# EAGLE design ModemAdapter (EAGLE 9.4.2)
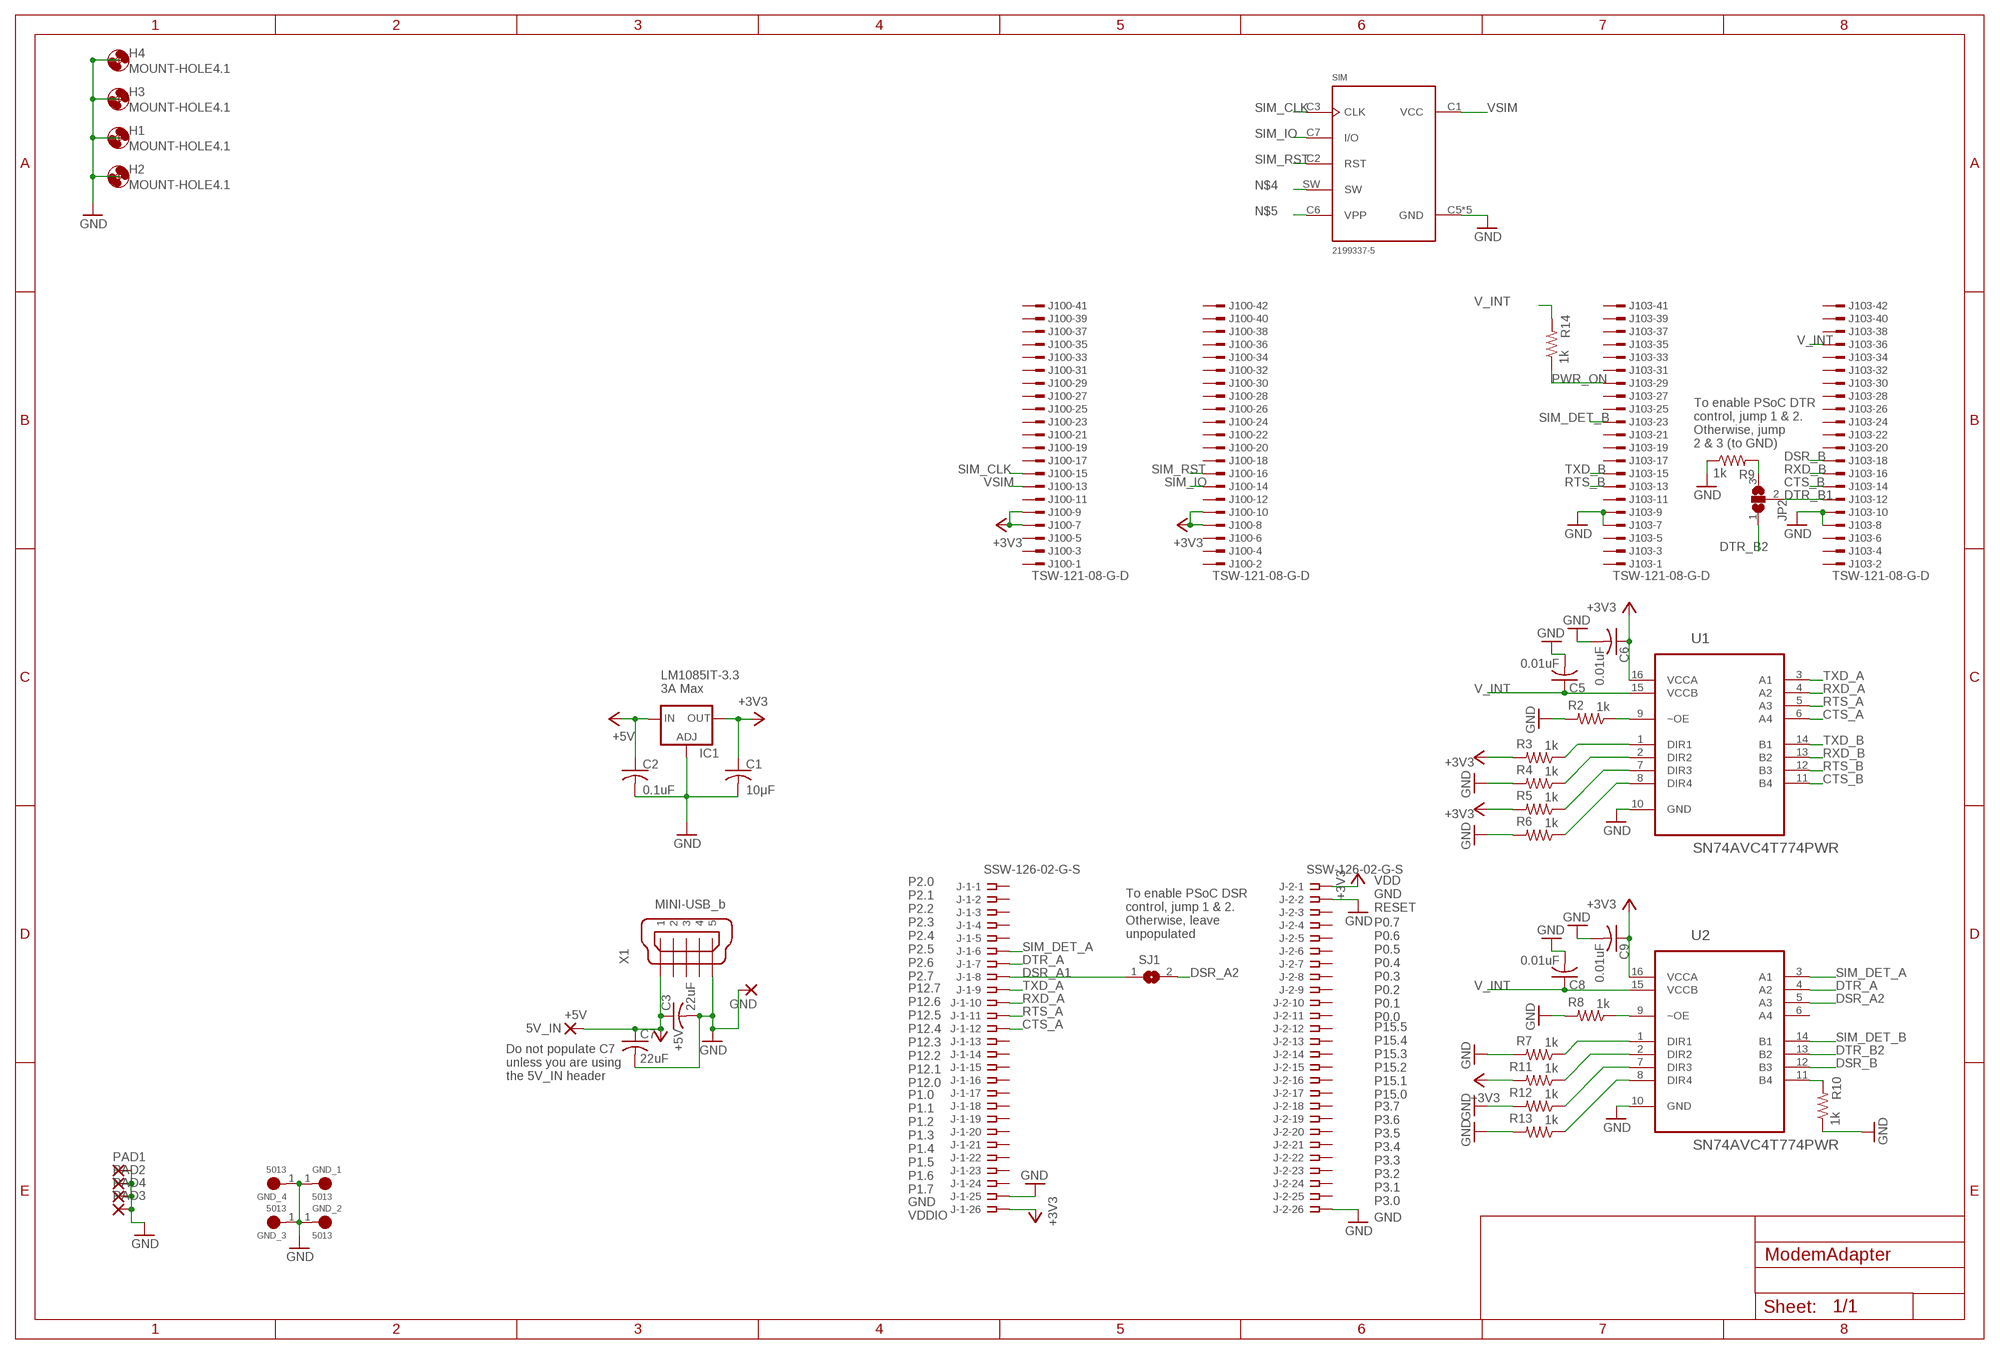
[diagram p0: schematic, sheet 1]

## Parts
+5V  5V_IN  3,17/1,1  [3,17/1,1]
C1  10μF  C-US050-024X044  [C050-024X044]
C2  0.1uF  C-US050-024X044  [C050-024X044]
C3  22uF  C-US050-024X044  [C050-024X044]
C5  0.01uF  C-US050-024X044  [C050-024X044]
C6  0.01uF  C-US050-024X044  [C050-024X044]
C7  22uF  C-US050-024X044  [C050-024X044]
C8  0.01uF  C-US050-024X044  [C050-024X044]
C9  0.01uF  C-US050-024X044  [C050-024X044]
GND  3,17/1,1  [3,17/1,1]
GND_1  5013  [TESTPOINT_5013]
GND_2  5013  [TESTPOINT_5013]
GND_3  5013  [TESTPOINT_5013]
GND_4  5013  [TESTPOINT_5013]
H1  MOUNT-HOLE4.1  [4,1]
H2  MOUNT-HOLE4.1  [4,1]
H3  MOUNT-HOLE4.1  [4,1]
H4  MOUNT-HOLE4.1  [4,1]
IC1  LD117AV33  [TO220L1]
J100  TSW-121-08-G-D  [TSW-121-XX-G-D]
J103  TSW-121-08-G-D  [TSW-121-XX-G-D]
J-1  SSW-126-02-G-S  [SSW-126-02-G-S]
J-2  SSW-126-02-G-S  [SSW-126-02-G-S]
JP2  SJ2W  [SJ_2]
PAD1  SMD2  [SMD1,27-2,54]
PAD2  SMD2  [SMD1,27-2,54]
PAD3  SMD2  [SMD1,27-2,54]
PAD4  SMD2  [SMD1,27-2,54]
R2  1k  R-US_0204/7  [0204/7]
R3  1k  R-US_0204/7  [0204/7]
R4  1k  R-US_0204/7  [0204/7]
R5  1k  R-US_0204/7  [0204/7]
R6  1k  R-US_0204/7  [0204/7]
R7  1k  R-US_0204/7  [0204/7]
R8  1k  R-US_0204/7  [0204/7]
R9  1k  R-US_0204/7  [0204/7]
R10  1k  R-US_0204/7  [0204/7]
R11  1k  R-US_0204/7  [0204/7]
R12  1k  R-US_0204/7  [0204/7]
R13  1k  R-US_0204/7  [0204/7]
R14  1k  R-US_0204/7  [0204/7]
SIM  2199337-5  [TE_2199337-5]
SJ1  SJ  [SJ]
U1  SN74AVC4T774PWR  [SOP65P640X120-16N]
U2  SN74AVC4T774PWR  [SOP65P640X120-16N]
X1  MINI-USB_b  MINI-USB_SHIELD5P2-32005-601  [32005-601]

## Nets
+3V3 [GND/voltage]: C1.1 C6.1 C9.1 IC1.2(OUT) J100.7 J100.8 J100.9 J100.10 J-1.26 J-2.1 R3.2 R5.2 R11.2 U1.16(VCCA) U2.16(VCCA)
+5V [GND/voltage]: +5V.1(P) C2.1 C3.1 C7.1 IC1.3(IN) X1.1
CTS_A: J-1.12 U1.6(A4)
CTS_B: J103.14 U1.11(B4)
DSR_A1: J-1.8 SJ1.1
DSR_A2: SJ1.2 U2.5(A3)
DSR_B: J103.18 U2.12(B3)
DTR_A: J-1.7 U2.4(A2)
DTR_B1: J103.12 JP2.2
DTR_B2: JP2.1 U2.13(B2)
GND [GND/voltage]: C1.2 C2.2 C3.2 C5.2 C6.2 C7.2 C8.2 C9.2 GND.1(P) GND_1.1(TP) GND_2.1(TP) GND_3.1(TP) GND_4.1(TP) IC1.1(ADJ) J103.7 J103.8 J103.9 J103.10 J-1.25 J-2.2 J-2.26 PAD1.1(P) PAD2.1(P) PAD3.1(P) PAD4.1(P) R2.2 R4.2 R6.2 R7.2 R8.2 R9.1 R10.1 R12.2 R13.2 SIM.C5(GND) SIM.G1(GND) SIM.G2(GND) SIM.G3(GND) SIM.G4(GND) U1.10(GND) U2.10(GND) X1.5
N$1: R3.1 U1.1(DIR1)
N$2: R4.1 U1.2(DIR2)
N$3: R5.1 U1.7(DIR3)
N$4: SIM.SW
N$5: SIM.C6(VPP)
N$6: R6.1 U1.8(DIR4)
N$7: R7.1 U2.1(DIR1)
N$8: R11.1 U2.2(DIR2)
N$9: R12.1 U2.7(DIR3)
N$10: R8.1 U2.9(~OE)
N$11: JP2.3 R9.2
N$12: R13.1 U2.8(DIR4)
N$13: R10.2 U2.11(B4)
N$18: R2.1 U1.9(~OE)
PWR_ON: J103.29 R14.1
RTS_A: J-1.11 U1.5(A3)
RTS_B: J103.13 U1.12(B3)
RXD_A: J-1.10 U1.4(A2)
RXD_B: J103.16 U1.13(B2)
SIM_CLK: J100.15 SIM.C3(CLK)
SIM_DET_A: J-1.6 U2.3(A1)
SIM_DET_B: J103.23 U2.14(B1)
SIM_IO: J100.14 SIM.C7(I/O)
SIM_RST: J100.16 SIM.C2(RST)
TXD_A: J-1.9 U1.3(A1)
TXD_B: J103.15 U1.14(B1)
V_INT: C5.1 C8.1 J103.36 R14.2 U1.15(VCCB) U2.15(VCCB)
VSIM: J100.13 SIM.C1(VCC)
Unconnected: J100.1 J100.2 J100.3 J100.4 J100.5 J100.6 J100.11 J100.12 J100.17 J100.18 J100.19 J100.20 J100.21 J100.22 J100.23 J100.24 J100.25 J100.26 J100.27 J100.28 J100.29 J100.30 J100.31 J100.32 J100.33 J100.34 J100.35 J100.36 J100.37 J100.38 J100.39 J100.40 J100.41 J100.42 J103.1 J103.2 J103.3 J103.4 J103.5 J103.6 J103.11 J103.17 J103.19 J103.20 J103.21 J103.22 J103.24 J103.25 J103.26 J103.27 J103.28 J103.30 J103.31 J103.32 J103.33 J103.34 J103.35 J103.37 J103.38 J103.39 J103.40 J103.41 J103.42 J-1.1 J-1.2 J-1.3 J-1.4 J-1.5 J-1.13 J-1.14 J-1.15 J-1.16 J-1.17 J-1.18 J-1.19 J-1.20 J-1.21 J-1.22 J-1.23 J-1.24 J-2.3 J-2.4 J-2.5 J-2.6 J-2.7 J-2.8 J-2.9 J-2.10 J-2.11 J-2.12 J-2.13 J-2.14 J-2.15 J-2.16 J-2.17 J-2.18 J-2.19 J-2.20 J-2.21 J-2.22 J-2.23 J-2.24 J-2.25 U2.6(A4) X1.2 X1.3 X1.4 X1.M1(S1) X1.M2(S2)

## Notes on the sheet
- To enable PSoC DTR 
  control, jump 1 & 2.
  Otherwise, jump
  2 & 3 (to GND)
- LM1085IT-3.3
  3A Max
- VDD
  GND
  RESET
- To enable PSoC DSR 
  control, jump 1 & 2.
  Otherwise, leave 
  unpopulated
- P2.0
  P2.1
  P2.2
  P2.3
  P2.4
  P2.5
  P2.6
  P2.7
- P0.7
  P0.6
  P0.5
  P0.4
  P0.3
  P0.2
  P0.1
  P0.0
- Do not populate C7 
  unless you are using 
  the 5V_IN header
- P12.7
  P12.6
  P12.5
  P12.4
  P12.3
  P12.2
  P12.1
  P12.0
- P15.5
  P15.4
  P15.3
  P15.2
  P15.1
  P15.0
- P1.0
  P1.1
  P1.2
  P1.3
  P1.4
  P1.5
  P1.6
  P1.7
- P3.7
  P3.6
  P3.5
  P3.4
  P3.3
  P3.2
  P3.1
  P3.0
- GND
  VDDIO
- GND

## Library data of the parts
+5V GND = wirepad:3,17/1,1: THROUGH-HOLE PAD
C1-C3 C5-C9 = adafruit:C-US: CAPACITOR, American symbol
GND_1-GND_4 = 5013:5013: Test Point; Orange; Thru-Hole; Snap-Fit; SilverPlate; 0.063in. Dia.; 0.445In.; AVAILABILITY: Unavailable; DESCRIPTION: Test Point; Orange; Thru-Hole; Snap-Fit; SilverPlate; 0.063in. Dia.; 0.445In.; MF: Keystone Electronics; MP: 5013; PACKAGE: TO-5 Keystone; PRICE: None
H1-H4 = holes:MOUNT-HOLE: MOUNTING HOLE with drill center marker
IC1 = v-reg:LD117A?*: Low drop fixed and adjustable positive voltage regulators 1 A Source: http://www.st.com/stonline/products/literature/ds/7194/ld1117axx.pdf
J100 J103 = con-samtec:TSW-121-*-G: THROUGH-HOLE .025" SQ POST HEADER Source: Samtec TSW.pdf; MF: Samtec Inc.; MPN: TSW-121-07-G-D
J-1 J-2 = con-samtec:SSW-126-02-G-S: THROUGH-HOLE .025" SQ POST SOCKET Source: Samtec SSW.pdf; MF: Samtec Inc.; MPN: SSW-126-02-G-S; OC_FARNELL: unknown; OC_NEWARK: 11P9742
JP2 = jumper:SJ2W: SMD solder JUMPER
PAD1-PAD4 = wirepad:SMD2: SMD PAD
R2-R14 = resistor:R-US_: RESISTOR, American symbol
SIM = 2199337-5:2199337-5: CONN MICRO SIM CARD PUSH-PULL; CENTERLINE_PITCH: 2.54 mm[.1 in]; COMMENT: 2199337-5; DESCRIPTION: ASS'Y FOR MICRO SIM H1.18 8POS _EMBOSS_; DIGI-KEY_PART_NUMBER: A125065CT-ND; DIGI-KEY_PURCHASE_URL: https://www.digikey.com/product-detail/en/te-connectivity-amp-connectors/2199337-5/A125065CT-ND/6810766?utm_source=snapeda&utm_medium=aggregator&utm_campaign=symbol; EU_ROHS_COMPLIANCE: Compliant; MF: TE Connectivity; MP: 2199337-5; NUMBER_OF_POSITIONS: 8; PACKAGE: None; PRODUCT_TYPE: Connector; TE_PURCHASE_URL: https://www.te.com/usa-en/product-2199337-5.html?te_bu=Cor&te_type=disp&te_campaign=seda_glo_cor-seda-global-disp-prtnr-fy19-seda-model-bom-cta_sma-317_1&elqCampaignId=32493
SJ1 = jumper:SJ: SMD solder JUMPER
U1 U2 = SN74AVC4T774PWR:SN74AVC4T774PWR: 4-BIT DUAL-SUPPLY BUS TRANSCEIVER; DESCRIPTION: 4-Bit Dual-Supply Bus Transceiver With Configurable Voltage-Level Shifting and 3-State Outputs 16-TSSOP -40 to 85; DIGI-KEY_PART_NUMBER: 296-24739-1-ND; DIGI-KEY_PURCHASE_URL: https://www.digikey.com/product-detail/en/texas-instruments/SN74AVC4T774PWR/296-24739-1-ND/2092561?utm_source=snapeda&utm_medium=aggregator&utm_campaign=symbol; MF: Texas Instruments; MP: SN74AVC4T774PWR; PACKAGE: TSSOP-16 Texas Instruments
X1 = con-cypressindustries:MINI-USB_SHIELD5P2-: MINI USB-B R/A DIP 5pol. Source: www.cypressindustries.com; OC_FARNELL: unknown; OC_NEWARK: unknown

## Net classes
0 default: width 0.203 mm, clearance 0.203 mm
1 GND/voltage: width 0.457 mm, drill 0.152 mm, clearance 0.203 mm

## Board
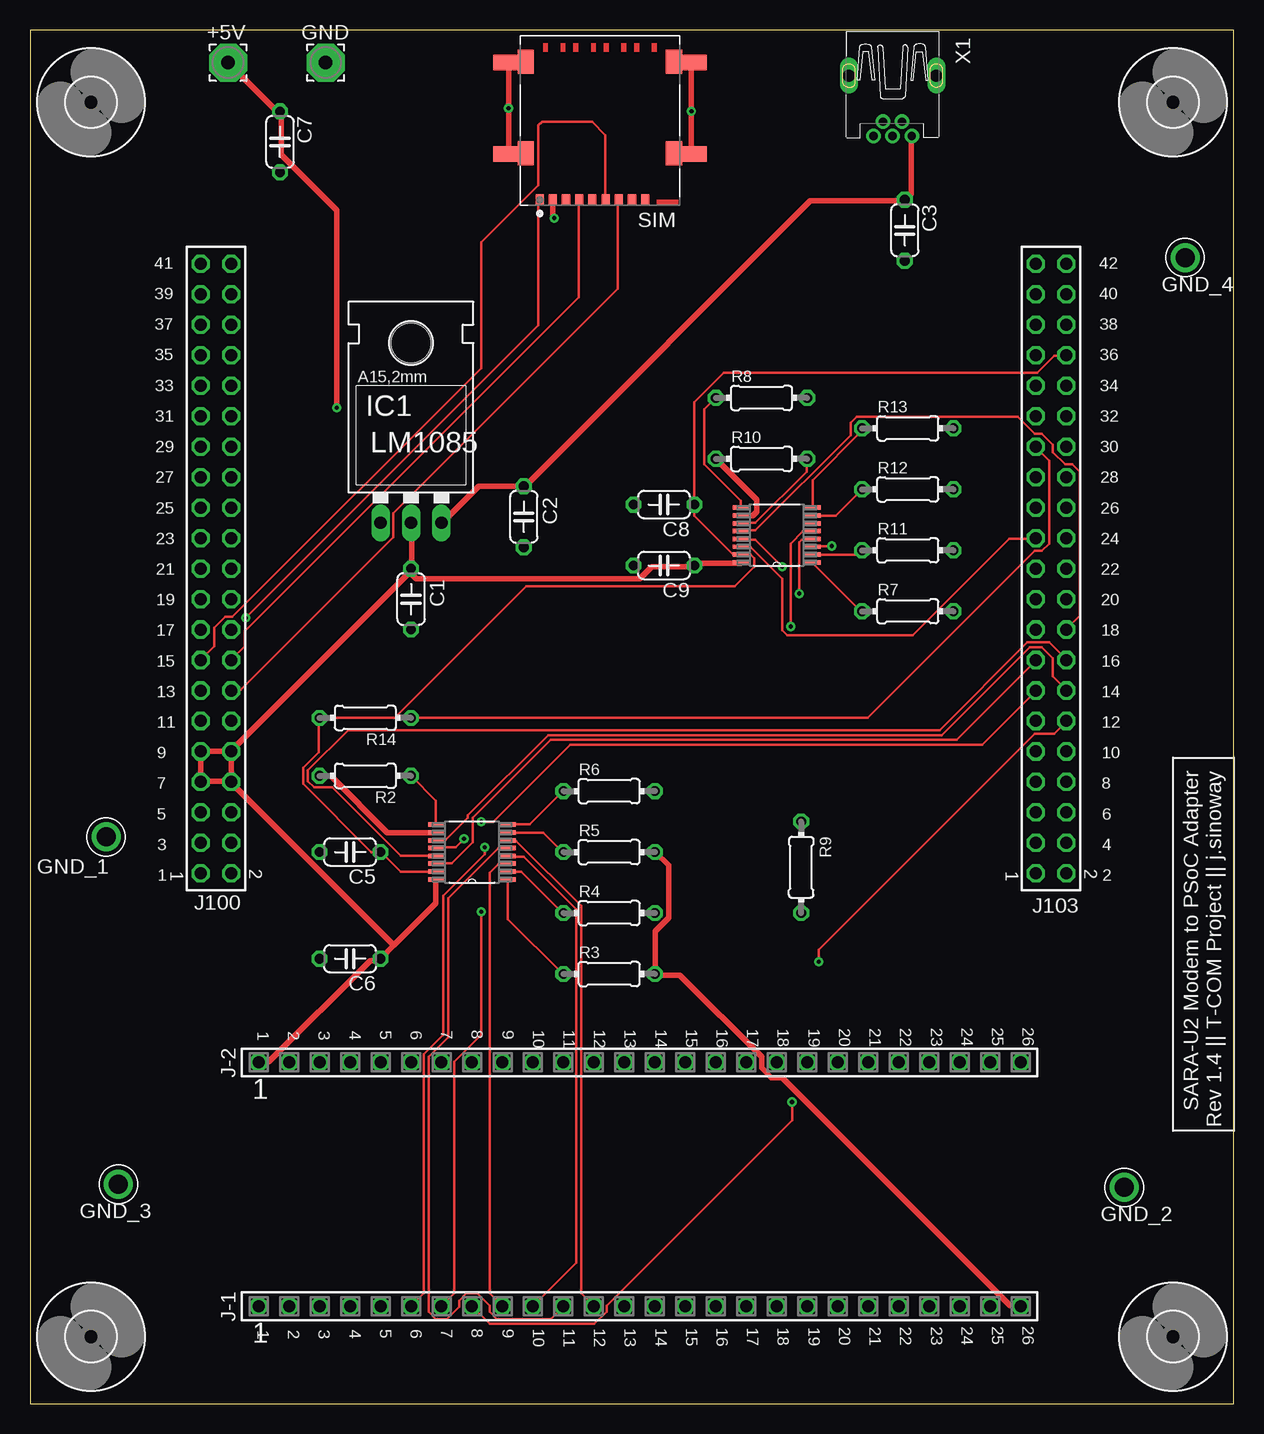
[diagram p1: board, top side]
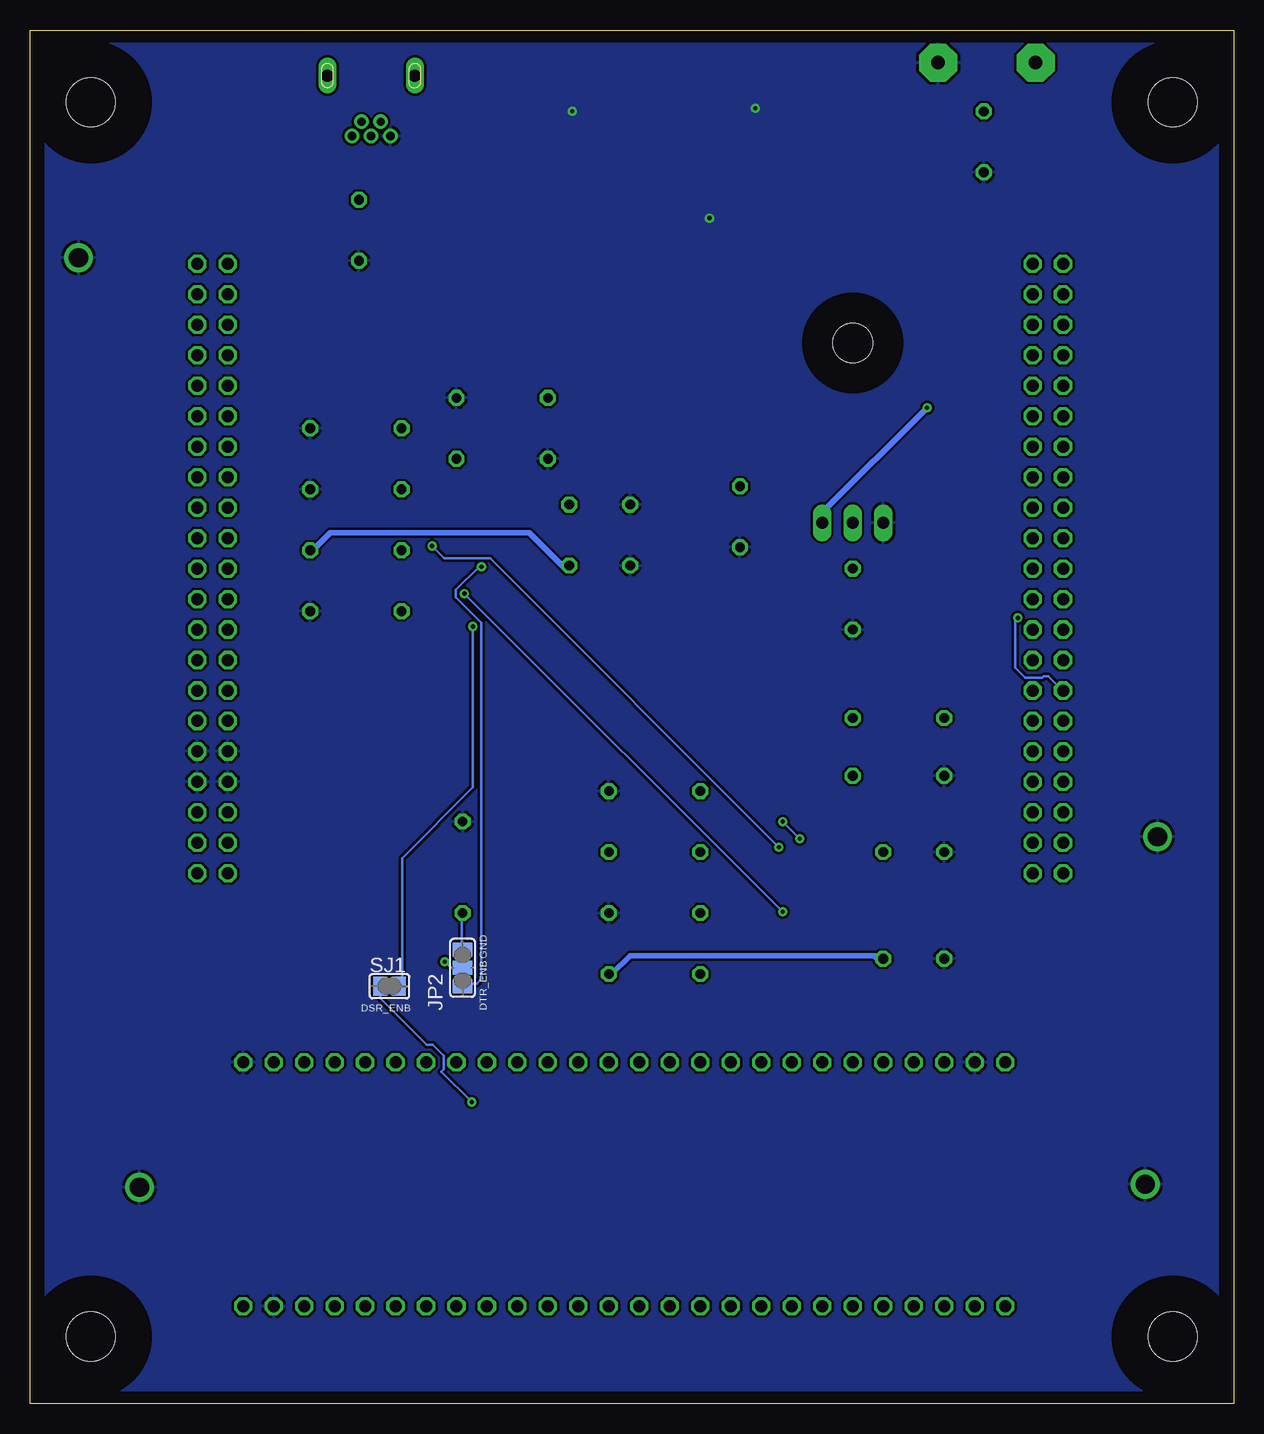
[diagram p2: board, bottom side, seen from below]

Size 100.31 x 114.48 mm. Coordinates in mm from the lower left corner, seen from the top.
Outline: 0,0 100.31,0 100.31,114.48 0,114.48 0,0
Copper layers (1*16): Top 0.035mm / dielectric 1.5mm / Bottom 0.035mm
Design rules "default": minimum track width 6mil, minimum drill 0.35mm, track to track 6mil, track to pad 6mil, pad to pad 6mil, via to via 6mil, smd to smd 6mil, copper to edge 40mil, drill to drill 6mil, minimum pad ring 10mil, minimum via ring 8mil, stop-mask expansion 4mil, vias tented up to drill 0mil, thermal gap 10mil

### Footprints (pad centres in the part's own frame; a part is rotated, then mirrored left to right if it is on the bottom)
3,17/1,1 = drill 1.118 pad 3.175 octagon: 1 0,0
C050-024X044 = drill 0.813 octagon: 1 -2.54,0; 2 2.54,0
TESTPOINT_5013 = drill 1.6: 1 0,0
4,1 = hole 4.1: 0,0
TO220L1 = drill 1.016 long: 1 -2.54,-3.81; 2 0,-3.81; 3 2.54,-3.81 | hole 3.302: 0,11.176
TSW-121-XX-G-D = drill 1 pad 1.5 octagon: 1 25.4,-1.27; 2 25.4,1.27; 3 22.86,-1.27; 4 22.86,1.27; 5 20.32,-1.27; 6 20.32,1.27; 7 17.78,-1.27; 8 17.78,1.27; 9 15.24,-1.27; 10 15.24,1.27; 11 12.7,-1.27; 12 12.7,1.27; 13 10.16,-1.27; 14 10.16,1.27; 15 7.62,-1.27; 16 7.62,1.27; 17 5.08,-1.27; 18 5.08,1.27; 19 2.54,-1.27; 20 2.54,1.27; 21 0,-1.27; 22 0,1.27; 23 -2.54,-1.27; 24 -2.54,1.27; 25 -5.08,-1.27; 26 -5.08,1.27; 27 -7.62,-1.27; 28 -7.62,1.27; 29 -10.16,-1.27; 30 -10.16,1.27; 31 -12.7,-1.27; 32 -12.7,1.27; 33 -15.24,-1.27; 34 -15.24,1.27; 35 -17.78,-1.27; 36 -17.78,1.27; 37 -20.32,-1.27; 38 -20.32,1.27; 39 -22.86,-1.27; 40 -22.86,1.27; 41 -25.4,-1.27; 42 -25.4,1.27
SSW-126-02-G-S = drill 1 pad 1.5 octagon: 1 -31.75,0; 2 -29.21,0; 3 -26.67,0; 4 -24.13,0; 5 -21.59,0; 6 -19.05,0; 7 -16.51,0; 8 -13.97,0; 9 -11.43,0; 10 -8.89,0; 11 -6.35,0; 12 -3.81,0; 13 -1.27,0; 14 1.27,0; 15 3.81,0; 16 6.35,0; 17 8.89,0; 18 11.43,0; 19 13.97,0; 20 16.51,0; 21 19.05,0; 22 21.59,0; 23 24.13,0; 24 26.67,0; 25 29.21,0; 26 31.75,0
SJ_2 = smd 1.168 x 1.6: 1 -1.524,0; 2 0,0; 3 1.524,0
SMD1,27-2,54 = smd 1.27 x 2.54: 1 0,0
0204/7 = drill 0.813 octagon: 1 -3.81,0; 2 3.81,0
TE_2199337-5 = smd 0.67 x 0.95: C1 5.03,6.625; C2 1.73,6.625; C3 -0.47,6.625; C4 -2.67,6.625; C5 3.93,6.625; C6 0.63,6.625; C7 -1.57,6.625; C8 -3.77,6.625; SW 2.83,6.625 | smd 1.35 x 2: G1 -6.175,2.72; G2 6.175,2.72; G3 6.175,-4.9; G4 -6.175,-4.9
SJ = smd 1.168 x 1.6: 1 -0.762,0; 2 0.762,0
SOP65P640X120-16N = smd 1.473 x 0.356: 1 -2.921,2.286; 2 -2.921,1.626; 3 -2.921,0.965; 4 -2.921,0.33; 5 -2.921,-0.33; 6 -2.921,-0.965; 7 -2.921,-1.626; 8 -2.921,-2.286; 9 2.921,-2.286; 10 2.921,-1.626; 11 2.921,-0.965; 12 2.921,-0.33; 13 2.921,0.33; 14 2.921,0.965; 15 2.921,1.626; 16 2.921,2.286
32005-601 = drill 0.7 pad 1.016: 1 2.825,1.6; 2 1.625,0.8; 3 2.825,0; 4 1.625,-0.8; 5 2.825,-1.6 | drill 1 pad 1.422 long: M1 -2.225,3.65; M2 -2.225,-3.65

### Placement (x,y rotation side)
+5V  16.51,111.76 0 top
C1  31.75,67.06 270 top
C2  41.15,73.91 270 top
C3  72.9,97.79 270 top
C5  26.67,45.97 180 top
C6  26.67,37.08 180 top
C7  20.83,105.16 270 top
C8  52.83,74.93 180 top
C9  52.83,69.85 180 top
GND  24.64,111.76 0 top
GND_1  6.35,47.24 0 top
GND_2  91.19,18.03 0 top
GND_3  7.37,18.29 0 top
GND_4  96.27,95.5 0 top
H1  5.08,5.59 0 top
H2  95.25,108.46 0 top
H3  95.25,5.59 0 top
H4  5.08,108.46 0 top
IC1  31.75,77.22 0 top
J100  15.49,69.6 270 top
J103  85.09,69.6 270 top
J-1  50.8,8.13 0 top
J-2  50.8,28.45 0 top
JP2  64.26,36.32 90 bottom
PAD1  55.12,104.14 270 top
PAD2  55.12,111.76 270 top
PAD3  39.88,104.14 270 top
PAD4  39.88,111.76 270 top
R2  27.94,52.32 180 top
R3  48.26,35.81 0 top
R4  48.26,40.89 0 top
R5  48.26,45.97 0 top
R6  48.26,51.05 0 top
R7  73.15,66.04 0 top
R8  60.96,83.82 0 top
R9  64.26,44.7 270 top
R10  60.96,78.74 0 top
R11  73.15,71.12 0 top
R12  73.15,76.2 0 top
R13  73.15,81.28 0 top
R14  27.94,57.15 180 top
SIM  47.5,106.93 180 top
SJ1  70.36,34.8 0 bottom
U1  36.83,45.97 180 top
U2  62.23,72.39 180 top
X1  71.88,108.46 270 top

### Tracks (layer width: path | path; a pad name or v marks a point on that pad's centre or on a via)
+3V3
  Top 0.457: R5.2 52.12,45.97 53.24,44.86 53.24,40.49 52.12,39.37 52.12,35.81 R3.2 52.32,35.71 54.15,35.71 60.96,28.91 60.96,27.99 61.77,27.18 62.69,27.18 81.69,8.18 82.5,8.18 J-1.26 | 30.33,38.2 C6.1 29.06,36.93 28.35,36.93 19.91,28.5 19.1,28.5 J-2.1 | 30.33,38.2 33.83,41.71 33.83,43.64 U1.16 | U2.16 59.23,70.05 55.58,70.05 C9.1 55.17,69.75 51.82,69.75 50.8,68.73 32.21,68.73 31.8,69.14 C1.1 | C1.1 31.8,69.65 31.8,73.41 IC1.2 | J100.8 16.76,51.87 14.43,51.87 J100.7 J100.9 J100.10 | J100.8 J100.10 | C1.1 31.6,69.44 31.6,69.24 16.87,54.51 J100.10 | 30.33,38.2 16.87,51.66 J100.8
  Bottom 0.457: C9.1 55.47,69.75 55.88,69.75 58.73,72.59 75.29,72.59 76.71,71.17 76.91,71.17 R11.2 | R3.2 51.82,35.81 50.29,37.34 29.97,37.34 29.67,37.03 29.26,37.03 C6.1
+5V  (via drill 0.35)
  Top 0.457: +5V.1 20.52,107.75 20.83,107.75 C7.1 20.93,107.54 20.93,104.09 25.55,99.47 v25.55,83.01 | X1.1 73.46,105.61 73.46,100.84 72.95,100.33 C3.1 72.75,100.23 65.02,100.23 41.35,76.56 C2.1 37.39,76.45 34.34,73.41 IC1.3
  Bottom 0.457: v25.55,83.01 34.24,74.32 34.24,73.41 IC1.3
CTS_A
  Top 0.203: J-1.12 45.92,9.19 45.92,41.5 40.54,46.89 39.83,46.89 U1.6
CTS_B
  Top 0.203: U1.11 33.93,46.99 34.65,46.99 36.47,48.82 36.47,49.02 43.18,55.73 76,55.73 83.31,63.04 84.33,63.04 85.24,62.13 85.24,60.6 86.36,59.49 J103.14
DSR_A1  (via drill 0.35)
  Top 0.203: v63.5,25.15 63.5,23.62 48.06,8.18 48.06,7.67 47.04,6.65 38.3,6.65 J-1.8
  Bottom 0.203: SJ1.1 71.12,33.78 67.26,29.92 66.75,29.92 65.84,29.01 65.84,27.89 66.04,27.69 v63.5,25.15
DSR_A2  (via drill 0.35)
  Top 0.203: v63.4,64.77 63.4,71.68 64.41,72.69 65.13,72.69 U2.5
  Bottom 0.203: v63.4,64.77 63.4,51.36 69.29,45.47 69.29,35.1 SJ1.2
DSR_B
  Top 0.203: U2.12 59.33,72.8 60.45,72.8 68.38,80.72 68.38,81.74 68.89,82.25 82.3,82.25 83.72,80.82 84.33,80.82 85.24,79.91 85.24,79.3 86.26,78.28 86.87,78.28 87.48,77.67 87.48,65.68 86.36,64.57 J103.18
DTR_A  (via drill 0.35)
  Top 0.203: v64.11,67.51 64.11,71.78 64.31,71.98 65.13,71.98 U2.4 | v37.59,41 37.59,30.73 35.36,28.5 35.36,9.19 J-1.7
  Bottom 0.203: v37.59,41 v64.11,67.51
DTR_B1  (via drill 0.35)
  Top 0.203: v65.73,36.83 65.73,37.85 83.72,55.83 85.34,55.83 86.36,56.84 J103.12
  Bottom 0.203: JP2.2 65.23,36.32 v65.73,36.83
DTR_B2  (via drill 0.35)
  Top 0.203: v62.69,69.75 60.45,71.98 59.33,71.98 U2.13
  Bottom 0.203: v62.69,69.75 62.89,69.75 64.82,67.82 64.82,67.21 62.69,65.07 62.69,35.41 63.09,35 64.01,35 64.21,34.8 JP2.1
GND  (via drill 0.35)
  Top 0.457: SIM.C5 43.57,98.93 v43.69,98.81 | U1.10 29.77,47.6 25.09,52.27 24.18,52.27 R2.2 | U2.10 60.25,74.02 60.55,74.32 60.55,75.34 R10.1 | SIM.G2 41.25,104.19 40.03,104.19 PAD3.1 v39.88,107.95 PAD4.1 40.03,111.81 41.25,111.81 SIM.G3 | SIM.G1 53.75,104.19 54.97,104.19 PAD1.1 v55.12,107.7 PAD2.1 54.97,111.81 53.75,111.81 SIM.G4
  pour Bottom: 99.06,0.51 1.27,0.51 1.27,113.79 99.06,113.79
N$1
  Top 0.203: U1.1 39.83,43.64 39.83,40.39 44.4,35.81 R3.1
N$2
  Top 0.203: U1.2 40.95,44.35 44.4,40.89 R4.1
N$3
  Top 0.203: U1.7 42.77,47.6 44.4,45.97 R5.1
N$6
  Top 0.203: U1.8 39.83,48.31 41.66,48.31 44.4,51.05 R6.1
N$7
  Top 0.203: U2.1 65.23,70.05 69.29,65.99 R7.1
N$8
  Top 0.203: U2.2 68.99,70.76 R11.1
N$9
  Top 0.203: U2.7 67.16,74.02 R12.1
N$10
  Top 0.203: R8.1 56.19,82.85 56.19,78.28 59.23,75.23 59.23,74.73 U2.9
N$11
  Bottom 0.203: JP2.3 64.31,37.85 64.31,40.89 R9.2
N$12
  Top 0.203: U2.8 65.23,74.73 65.23,76.96 69.29,81.03 69.29,81.23 R13.1
N$13
  Top 0.203: U2.11 59.33,73.41 60.45,73.41 64.72,77.67 64.72,78.69 R10.2
N$18
  Top 0.203: R2.1 33.83,50.24 33.83,48.31 U1.9
PWR_ON
  Top 0.203: R14.1 69.8,57.15 83.72,71.07 84.33,71.07 84.94,71.68 84.94,78.59 83.82,79.7 J103.29
RTS_A
  Top 0.203: J-1.11 43.38,7.06 38.91,7.06 38.3,7.67 38.3,8.18 37.29,9.19 36.37,9.19 35.76,8.58 35.76,8.08 34.75,7.06 33.83,7.06 33.22,7.67 33.22,28.91 34.85,30.53 34.85,42.11 39.01,46.28 39.73,46.28 U1.5
RTS_B  (via drill 0.35)
  Top 0.203: v36.17,47.09 35.46,46.38 33.93,46.38 U1.12 | v37.59,48.51 38.61,48.51 45.01,54.91 79.35,54.91 83.82,59.38 J103.13
  Bottom 0.203: v37.59,48.51 v36.17,47.09
RXD_A
  Top 0.203: J-1.10 45.52,11.73 45.52,41.2 41.15,45.57 39.83,45.57 U1.4
RXD_B
  Top 0.203: U1.13 33.83,45.67 30.89,45.67 25.2,51.36 23.67,51.36 23.16,51.87 23.16,52.78 26.52,56.13 75.79,56.13 83.11,63.45 84.94,63.45 86.36,62.03 J103.16
SIM_CLK
  Top 0.203: SIM.C3 47.95,100.33 47.95,105.72 46.84,106.83 42.67,106.83 42.37,106.53 42.37,101.55 37.59,96.77 37.59,86.31 16.87,65.58 16.26,65.58 15.34,64.67 15.34,63.14 14.22,62.03 J100.15
SIM_DET_A  (via drill 0.35)
  Top 0.203: v66.8,71.48 65.23,71.48 U2.3 | v37.9,46.38 37.9,45.77 34.44,42.32 34.44,30.73 32.82,29.11 32.82,9.19 J-1.6
  Bottom 0.203: v66.8,71.48 65.79,70.46 61.98,70.46 v37.9,46.38
SIM_DET_B
  Top 0.203: U2.14 59.33,71.37 60.05,71.37 62.69,68.73 62.69,64.47 63.09,64.06 73.56,64.06 81.58,72.09 83.82,72.09 J103.23
SIM_IO
  Top 0.203: SIM.C7 48.97,100.23 48.97,92.91 30.28,74.22 30.28,72.19 17.58,59.49 16.76,59.49 J100.14
SIM_RST
  Top 0.203: SIM.C2 45.72,100.23 45.72,92.2 17.88,64.36 17.88,63.14 16.76,62.03 J100.16
TXD_A
  Top 0.203: J-1.9 38.3,9.19 38.3,44.25 39.01,44.96 39.73,44.96 U1.3
TXD_B
  Top 0.203: U1.14 33.93,45.06 35.15,45.06 36.88,46.79 36.88,48.82 43.38,55.32 77.22,55.32 83.82,61.92 J103.15
V_INT
  Top 0.203: U1.15 30.89,44.35 29.26,45.97 C5.1 28.45,45.97 22.76,51.66 22.76,52.98 24.08,54.3 24.08,57.15 R14.2 30.38,57.15 41.35,68.12 58.73,68.12 60.35,69.75 60.35,70.46 60.05,70.76 U2.15 58.62,70.76 55.37,74.02 C8.1 55.37,83.46 57.81,85.9 83.92,85.9 85.34,87.33 86.36,87.33 J103.36
VSIM  (via drill 0.35)
  Top 0.203: v17.98,65.48 42.37,89.86 42.37,100.23 SIM.C1
  Bottom 0.203: v17.98,65.48 18.19,65.28 18.19,61.32 17.37,60.5 15.95,60.5 15.85,60.6 15.44,60.6 14.22,59.38 J100.13

### Text on the board
tNames: LM1085 | SARA-U2 Modem to PSoC Adapter / Rev 1.4 || T-COM Project || j.sinoway | 41 / 39 / 37 / 35 / 33 / 31 / 29 / 27 / 25 / 23 / 21 / 19 / 17 / 15 / 13 / 11 / 9 / 7 / 5 / 3 / 1 | 42 / 40 / 38 / 36 / 34 / 32 / 30 / 28 / 26 / 24 / 22 / 20 / 18 / 16 / 14 / 12 / 10 / 8 / 6 / 4 / 2 | 26 / 25 / 24 / 23 / 22 / 21 / 20 / 19 / 18 / 17 / 16 / 15 / 14 / 13 / 12 / 11 / 10 / 9 / 8 / 7 / 6 / 5 / 4 / 3 / 2 / 1 | 26 / 25 / 24 / 23 / 22 / 21 / 20 / 19 / 18 / 17 / 16 / 15 / 14 / 13 / 12 / 11 / 10 / 9 / 8 / 7 / 6 / 5 / 4 / 3 / 2 / 1
bNames: GND | DTR_ENB | DSR_ENB